# Altium project FPGA_VGA_MegaShield.PrjPcb
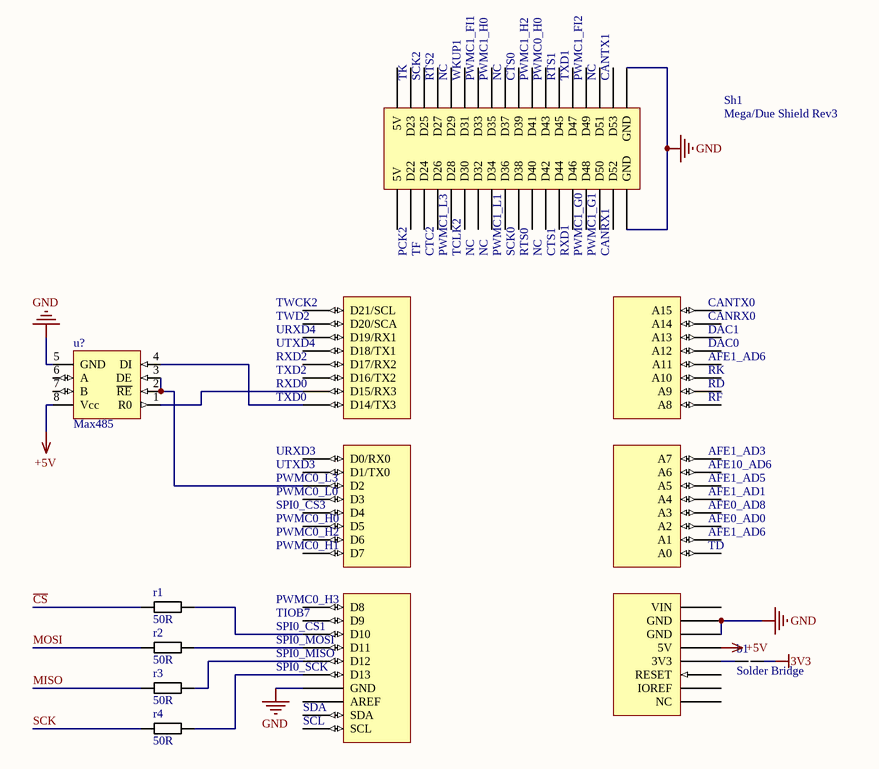
[diagram p0: Top sheet.SchDoc]
3 sheets, 30 parts. Net scope: global (net labels, ports and power ports of the same name join across sheets).
Board file: FPGA_VGA_MegaShield.PcbDoc
Sheets:
  Top sheet.SchDoc
  FPGA.SchDoc
  PSU-IO.SchDoc

## Sheet Top sheet.SchDoc
size A4

### Parts
b1  Solder Bridge  [Solder Bridge]
r1  50R  [0805]
r2  50R  [0805]
r3  50R  [0805]
r4  50R  [0805]
Sh1  Mega/Due Shield Rev3  [Mega2560_R3 Shield]
u?  Max485  [SOIC8N]

### Nets
3V3: b1.2
+5V: Sh1.5(5V) u?.8(Vcc)
GND: Sh1.6(GND) Sh1.7(GND) Sh1.47(GND) Sh1.83(GND) Sh1.84(GND) u?.5(GND)
~{CS}: r1.1
MISO: r3.1
MOSI: r2.1
SCK: r4.1
Netb1_1: b1.1 Sh1.4(3V3)
Netr1_2: r1.2 Sh1.43(D10)
Netr2_2: r2.2 Sh1.44(D11)
Netr3_2: r3.2 Sh1.45(D12)
Netr4_2: r4.2 Sh1.46(D13)
NetSh1_31: Sh1.31(D15/RX3) u?.1(R0)
NetSh1_32: Sh1.32(D14/TX3) u?.4(DI)
NetSh1_35: Sh1.35(D2) u?.2(~{RE}) u?.3(DE)

Not connected (* = marked no-connect by the designer): Sh1 1(NC) 2(IOREF) 3(RESET) 8(VIN) 9(A0) 10(A1) 11(A2) 12(A3) 13(A4) 14(A5) 15(A6) 16(A7) 17(A8) 18(A9) 19(A10) 20(A11) 21(A12) 22(A13) 23(A14) 24(A15) 25(D21/SCL) 26(D20/SCA) 27(D19/RX1) 28(D18/TX1) 29(D17/RX2) 30(D16/TX2) 33(D0/RX0) 34(D1/TX0) 36(D3) 37(D4) 38(D5) 39(D6) 40(D7) 41(D8) 42(D9) 48(AREF) 49(5V) 50(5V) 51(D22) 52(D23) 53(D24) 54(D25) 55(D26) 56(D27) 57(D28) 58(D29) 59(D30) 60(D31) 61(D32) 62(D33) 63(D34) 64(D35) 65(D36) 66(D37) 67(D38) 68(D39) 69(D40) 70(D41) 71(D42) 72(D43) 73(D44) 74(D45) 75(D46) 76(D47) 77(D48) 78(D49) 79(D50) 80(D51) 81(D52) 82(D53); u? 6(A) 7(B)

### Notes on the sheet
- (near Sh1) TK
- (near Sh1) SCK2
- (near Sh1) RTS2
- (near Sh1) NC
- (near Sh1) WKUP1
- (near Sh1) PWMC1_FI1
- (near Sh1) PWMC1_H0
- (near Sh1) CTS0
- (near Sh1) PWMC1_H2
- (near Sh1) PWMC0_H0
- (near Sh1) RTS1
- (near Sh1) TXD1
- (near Sh1) PWMC1_FI2
- (near Sh1) CANTX1
- (near Sh1) PCK2
- (near Sh1) TF
- (near Sh1) CTC2
- (near Sh1) PWMC1_L3
- (near Sh1) TCLK2
- (near Sh1) PWMC1_L1
- (near Sh1) SCK0
- (near Sh1) RTS0
- (near Sh1) CTS1
- (near Sh1) RXD1
- (near Sh1) PWMC1_G0
- (near Sh1) PWMC1_G1
- (near Sh1) CANRX1
- (near Sh1) URXD4
- (near Sh1) TWD2
- (near Sh1) TWCK2
- (near Sh1) DAC1
- (near Sh1) CANRX0
- (near Sh1) CANTX0
- (near Sh1) TXD0
- (near Sh1) RXD0
- (near Sh1) RXD2
- (near Sh1) TXD2
- (near Sh1) UTXD4
- (near Sh1) RF
- (near Sh1) RD
- (near Sh1) RK
- (near Sh1) AFE1_AD6
- (near Sh1) DAC0
- (near Sh1) UTXD3
- (near Sh1) URXD3
- (near Sh1) AFE10_AD6
- (near Sh1) AFE1_AD3
- (near Sh1) PWMC0_H2
- (near Sh1) SPI0_CS3
- (near Sh1) PWMC0_L0
- (near Sh1) PWMC0_L3
- (near Sh1) AFE0_AD0
- (near Sh1) AFE0_AD8
- (near Sh1) AFE1_AD1
- (near Sh1) AFE1_AD5
- (near Sh1) PWMC0_H3
- (near Sh1) PWMC0_H1
- (near Sh1) TD
- (near Sh1) SPI0_SCK
- (near Sh1) SPI0_MISO
- (near Sh1) SPI0_MOSI
- (near Sh1) SPI0_CS1
- (near Sh1) TIOB7
- (near Sh1) SCL
- (near Sh1) SDA

### Library data of the parts
r1-r4 = 0805 Resistor: ...R
u? = Max485: SOIC8

## Sheet FPGA.SchDoc
size A4
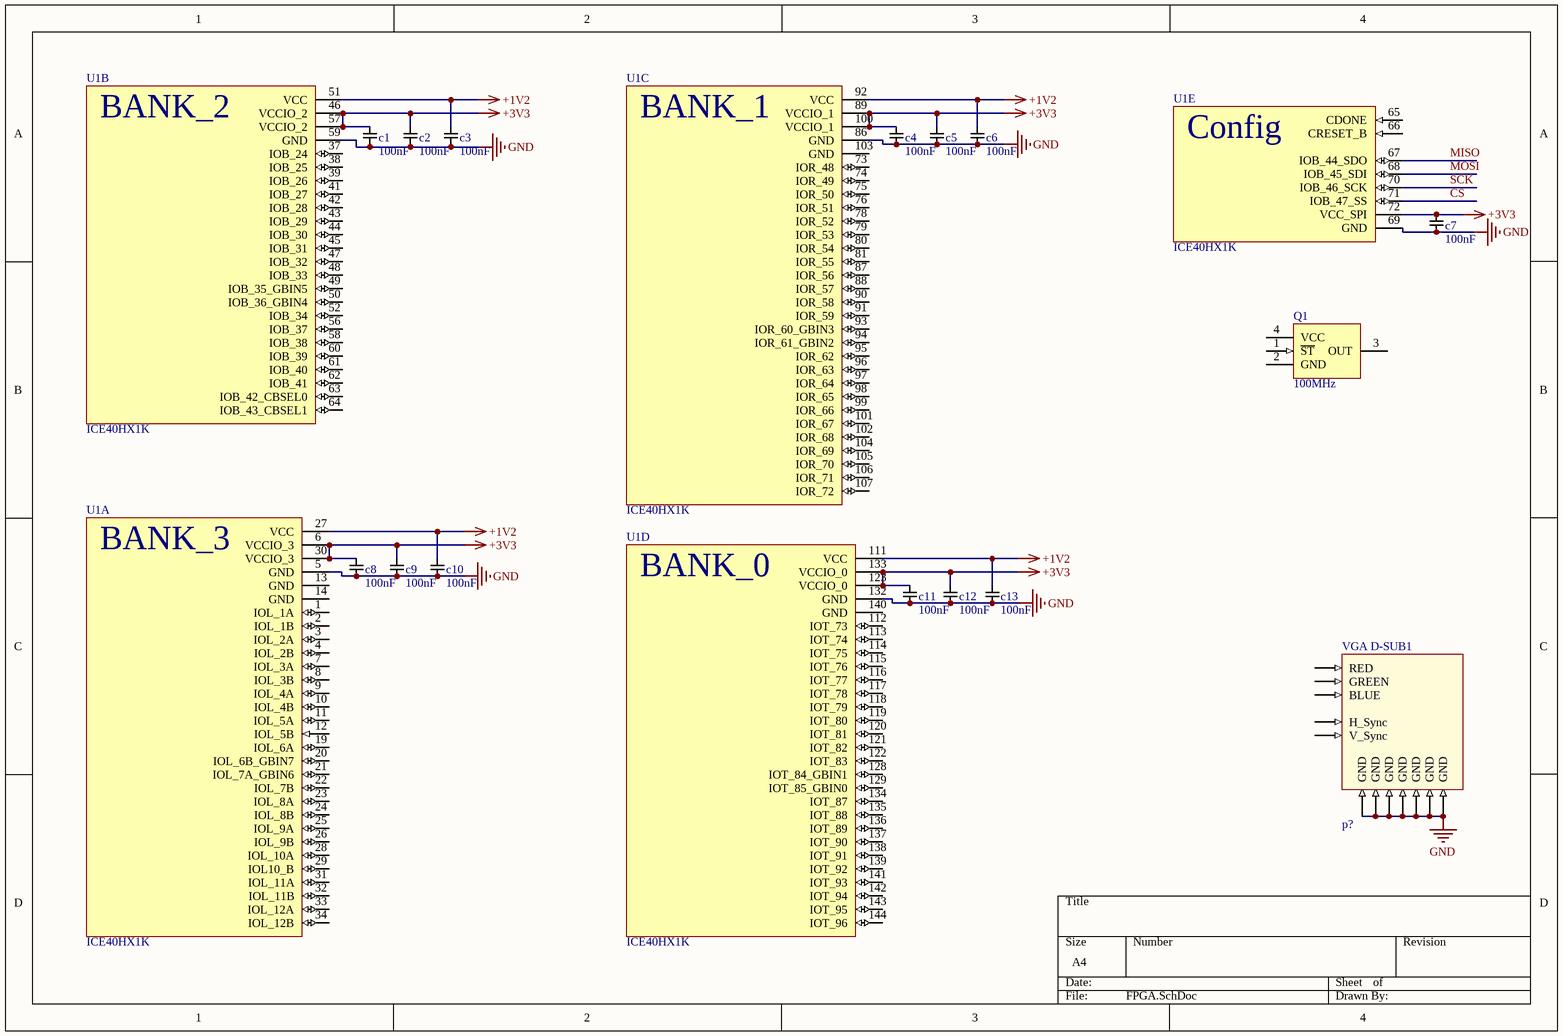
[diagram p1: FPGA.SchDoc]

### Parts
c1  100nF  [0603]
c2  100nF  [0603]
c3  100nF  [0603]
c4  100nF  [0603]
c5  100nF  [0603]
c6  100nF  [0603]
c7  100nF  [0603]
c8  100nF  [0603]
c9  100nF  [0603]
c10  100nF  [0603]
c11  100nF  [0603]
c12  100nF  [0603]
c13  100nF  [0603]
Q1  100MHz  [Crystal Oscillator-2.5X2mm]
U1  ICE40HX1K  [TQFP-144]  (parts A,B,C,D,E of 6)
VGA_D-SUB1  p?  [SUB-D15_VGA]

### Nets
+1V2: c3.2 c6.2 c10.2 c13.2 U1.27(VCC) U1.51(VCC) U1.92(VCC) U1.111(VCC)
+3V3: c1.2 c2.2 c4.2 c5.2 c7.2 c8.2 c9.2 c11.2 c12.2 U1.6(VCCIO_3) U1.30(VCCIO_3) U1.46(VCCIO_2) U1.57(VCCIO_2) U1.72(VCC_SPI) U1.89(VCCIO_1) U1.100(VCCIO_1) U1.123(VCCIO_0) U1.133(VCCIO_0)
GND: c1.1 c2.1 c3.1 c4.1 c5.1 c6.1 c7.1 c8.1 c9.1 c10.1 c11.1 c12.1 c13.1 U1.5(GND) U1.59(GND) U1.69(GND) U1.86(GND) U1.132(GND) VGA_D-SUB1.5(GND) VGA_D-SUB1.6(GND) VGA_D-SUB1.7(GND) VGA_D-SUB1.8(GND) VGA_D-SUB1.10(GND) VGA_D-SUB1.16(GND) VGA_D-SUB1.17(GND)
~{CS}: U1.71(IOB_47_SS)
MISO: U1.67(IOB_44_SDO)
MOSI: U1.68(IOB_45_SDI)
SCK: U1.70(IOB_46_SCK)

Not connected (* = marked no-connect by the designer): Q1 1(~{ST}) 2(GND) 3(OUT) 4(VCC); U1 1(IOL_1A) 2(IOL_1B) 3(IOL_2A) 4(IOL_2B) 7(IOL_3A) 8(IOL_3B) 9(IOL_4A) 10(IOL_4B) 11(IOL_5A) 12(IOL_5B) 13(GND) 14(GND) 19(IOL_6A) 20(IOL_6B_GBIN7) 21(IOL_7A_GBIN6) 22(IOL_7B) 23(IOL_8A) 24(IOL_8B) 25(IOL_9A) 26(IOL_9B) 28(IOL_10A) 29(IOL10_B) 31(IOL_11A) 32(IOL_11B) 33(IOL_12A) 34(IOL_12B) 37(IOB_24) 38(IOB_25) 39(IOB_26) 41(IOB_27) 42(IOB_28) 43(IOB_29) 44(IOB_30) 45(IOB_31) 47(IOB_32) 48(IOB_33) 49(IOB_35_GBIN5) 50(IOB_36_GBIN4) 52(IOB_34) 56(IOB_37) 58(IOB_38) 60(IOB_39) 61(IOB_40) 62(IOB_41) 63(IOB_42_CBSEL0) 64(IOB_43_CBSEL1) 65(CDONE) 66(CRESET_B) 73(IOR_48) 74(IOR_49) 75(IOR_50) 76(IOR_51) 78(IOR_52) 79(IOR_53) 80(IOR_54) 81(IOR_55) 87(IOR_56) 88(IOR_57) 90(IOR_58) 91(IOR_59) 93(IOR_60_GBIN3) 94(IOR_61_GBIN2) 95(IOR_62) 96(IOR_63) 97(IOR_64) 98(IOR_65) 99(IOR_66) 101(IOR_67) 102(IOR_68) 103(GND) 104(IOR_69) 105(IOR_70) 106(IOR_71) 107(IOR_72) 112(IOT_73) 113(IOT_74) 114(IOT_75) 115(IOT_76) 116(IOT_77) 117(IOT_78) 118(IOT_79) 119(IOT_80) 120(IOT_81) 121(IOT_82) 122(IOT_83) 128(IOT_84_GBIN1) 129(IOT_85_GBIN0) 134(IOT_87) 135(IOT_88) 136(IOT_89) 137(IOT_90) 138(IOT_91) 139(IOT_92) 140(GND) 141(IOT_93) 142(IOT_94) 143(IOT_95) 144(IOT_96); VGA_D-SUB1 1(RED) 2(GREEN) 3(BLUE) 13(H_Sync) 14(V_Sync)

### Notes on the sheet
- (in symbol ICE40HX1K, part A) BANK_3
- (in symbol ICE40HX1K, part B) BANK_2
- (in symbol ICE40HX1K, part C) BANK_1
- (in symbol ICE40HX1K, part D) BANK_0
- (in symbol ICE40HX1K, part E) Config

### Library data of the parts
c1-c13 = 0603 Capacitor: ...F
Q1 = SG-210S*H: Crystal Oscillator
U1 = ICE40HX1K: ICE40 FPGA TQFP-144
VGA_D-SUB1 = VGA connector: VGA receptor

## Sheet PSU-IO.SchDoc
size A4
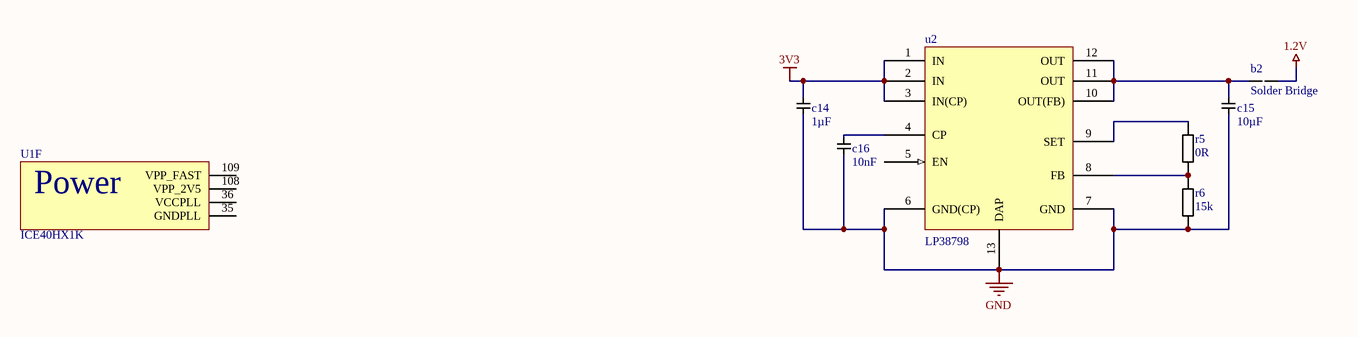
[diagram p2: PSU-IO.SchDoc]

### Parts
b2  Solder Bridge  [Solder Bridge]
c14  1µF  [1206]
c15  10µF  [1206]
c16  10nF  [0603]
r5  0R  [0603]
r6  15k  [0603]
U1  ICE40HX1K  [TQFP-144]  (part F of 6)
u2  LP38798  [WSON-12_4X4]

### Nets
1.2V: b2.2
3V3: c14.2 u2.1(IN) u2.2(IN) u2.3(IN(CP))
GND: c14.1 c15.1 c16.1 r6.1 u2.6(GND(CP)) u2.7(GND) u2.13(DAP)
Netb2_1: b2.1 c15.2 u2.10(OUT(FB)) u2.11(OUT) u2.12(OUT)
Netc16_2: c16.2 u2.4(CP)
Netr5_1: r5.1 r6.2 u2.8(FB)
Netr5_2: r5.2 u2.9(SET)

Not connected (* = marked no-connect by the designer): U1 35(GNDPLL) 36(VCCPLL) 108(VPP_2V5) 109(VPP_FAST); u2 5(EN)

### Notes on the sheet
- (in symbol ICE40HX1K, part F) Power

### Library data of the parts
c14 c15 = 1206 Cap: ...F
c16 = 0603 Capacitor: ...F
r5 r6 = 0603 Resistor: ...R
U1 = ICE40HX1K: ICE40 FPGA TQFP-144
u2 = LP38798: 800mA Ulta-Low-Noise, High-PSRR LDO

## Nets that join several sheets
3V3: Top sheet (b1.2), PSU-IO (c14.2 u2.1 u2.2 u2.3)
GND: Top sheet (6 pins), FPGA (25 pins), PSU-IO (7 pins)
~{CS}: Top sheet (r1.1), FPGA (U1.71)
MISO: Top sheet (r3.1), FPGA (U1.67)
MOSI: Top sheet (r2.1), FPGA (U1.68)
SCK: Top sheet (r4.1), FPGA (U1.70)